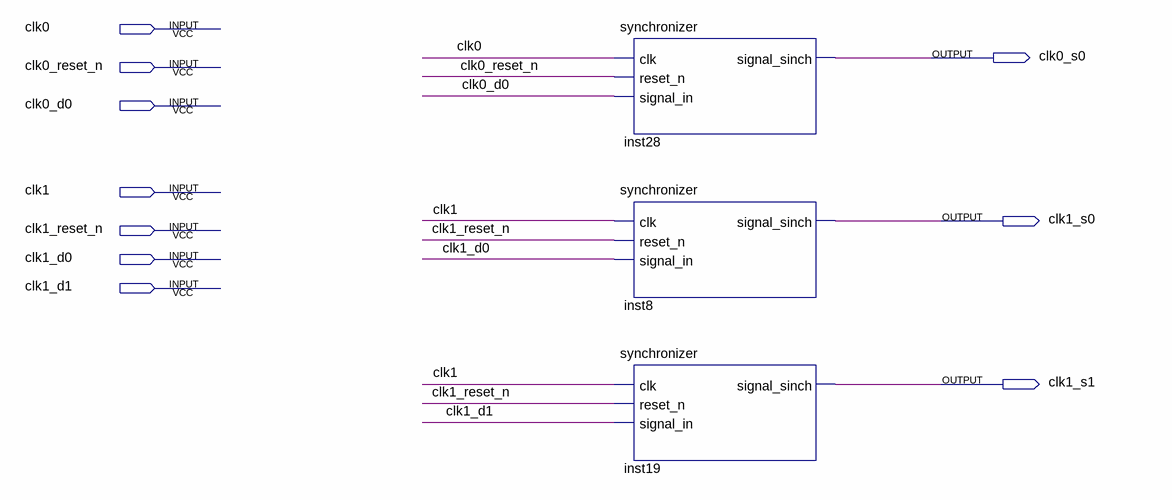
[diagram p0: schematic sheet]
// Quartus schematic rx_synchronizers.bdf as structural Verilog: 3 symbols, 10 pins
module rx_synchronizers (
  input  clk0,
  input  clk0_reset_n,
  input  clk0_d0,
  input  clk1,
  input  clk1_reset_n,
  input  clk1_d0,
  input  clk1_d1,
  output clk0_s0,
  output clk1_s0,
  output clk1_s1
);

  synchronizer inst28 (.clk(clk0), .reset_n(clk0_reset_n), .signal_in(clk0_d0), .signal_sinch(clk0_s0));
  synchronizer inst8 (.clk(clk1), .reset_n(clk1_reset_n), .signal_in(clk1_d0), .signal_sinch(clk1_s0));
  synchronizer inst19 (.clk(clk1), .reset_n(clk1_reset_n), .signal_in(clk1_d1), .signal_sinch(clk1_s1));
endmodule
